# Altium schematic sheet Yo-Radio.SchDoc
size A4; SheetNumber: 1; SheetTotal: 1
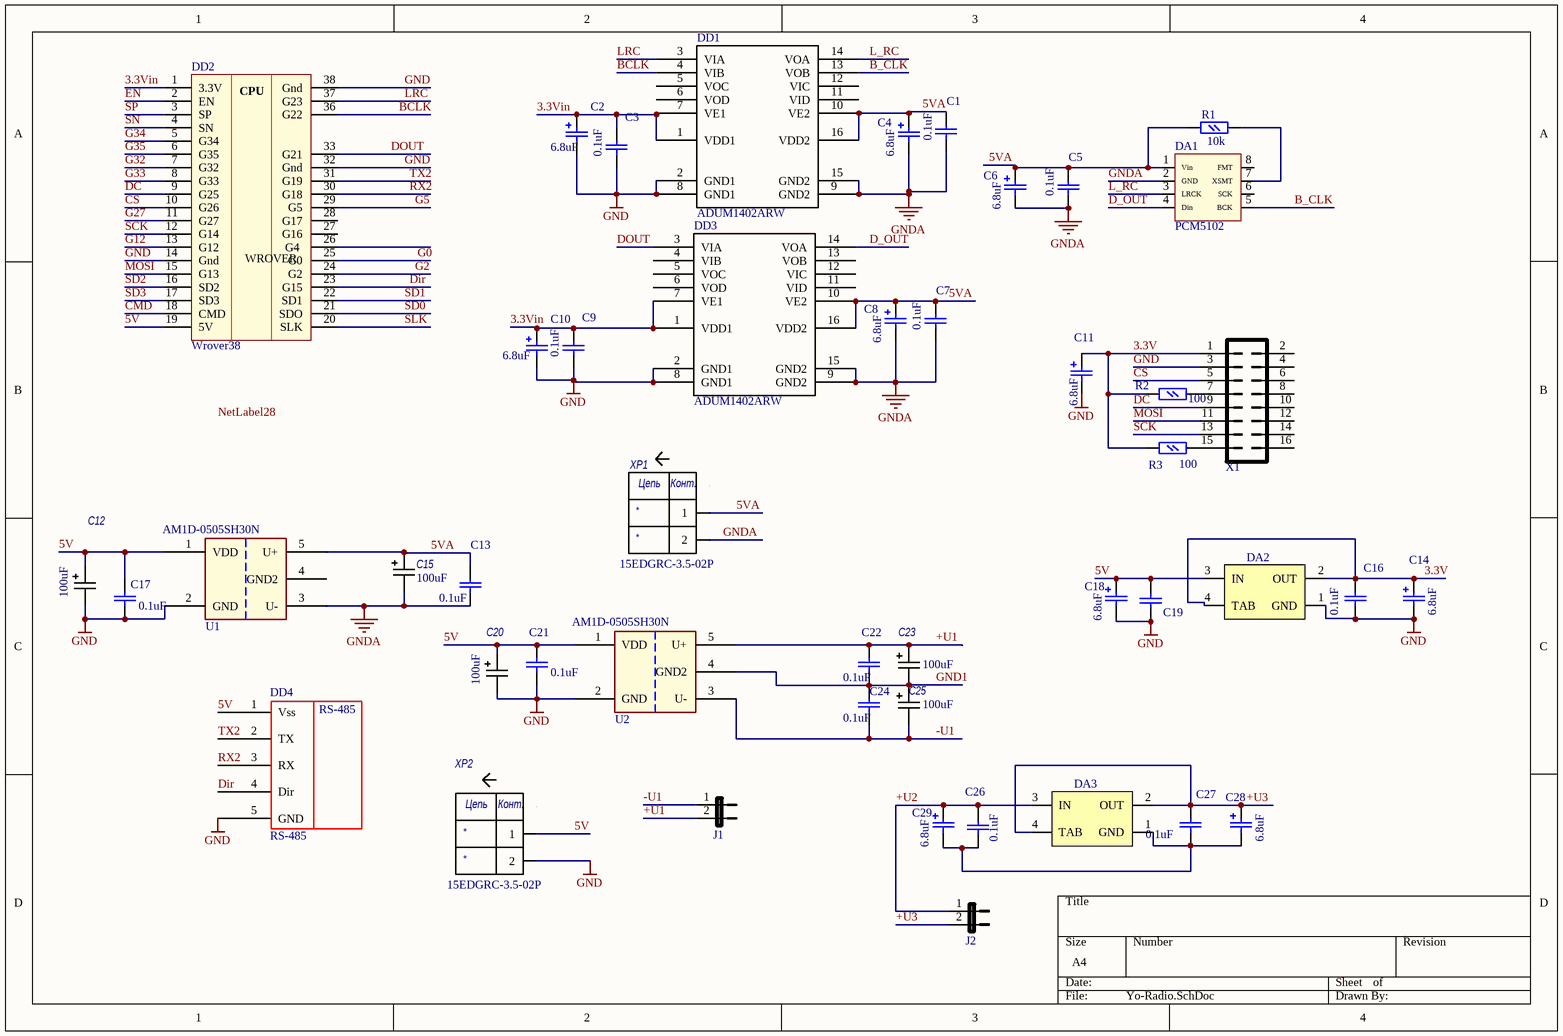
[diagram p0: Yo-Radio.SchDoc]

## Parts
C1  0.1uF  [cap0805]
C2  6.8uF  [TC3216-1206-A]
C3  0.1uF  [cap0805]
C4  6.8uF  [TC3216-1206-A]
C5  0.1uF  [cap0805]
C6  6.8uF  [TC3216-1206-A]
C7  0.1uF  [cap0805]
C8  6.8uF  [TC3216-1206-A]
C9  0.1uF  [cap0805]
C10  6.8uF  [TC3216-1206-A]
C11  6.8uF  [TC3216-1206-A]
C12  ValueSCH: 100uF  [TC7360-2924-E]
C13  0.1uF  [cap0805]
C14  6.8uF  [TC3216-1206-A]
C15  100uF  [TC7360-2924-E]
C16  0.1uF  [cap0805]
C17  0.1uF  [cap0805]
C18  6.8uF  [TC3216-1206-A]
C19  *  [cap0805]  (value not drawn)
C20  ValueSCH: 100uF  [TC7360-2924-E]
C21  0.1uF  [cap0805]
C22  0.1uF  [cap0805]
C23  100uF  [TC7360-2924-E]
C24  0.1uF  [cap0805]
C25  100uF  [TC7360-2924-E]
C26  0.1uF  [cap0805]
C27  0.1uF  [cap0805]
C28  6.8uF  [TC3216-1206-A]
C29  6.8uF  [TC3216-1206-A]
DA1  PCM5102  [PCM5102]
DA2  LM1117MP-3.3  [SOT223]  (value not drawn)
DA3  LM1117MP-3.3  [SOT223]  (value not drawn)
DD1  ADUM1402ARW  [WSO-16]
DD2  Wrover38  [Wrover]
DD3  ADUM1402ARW  [WSO-16]
DD4  RS-485  [RS-485]
J1  PLS-2  [PLS-2]  (value not drawn)
J2  PLS-2  [PLS-2]  (value not drawn)
R1  10k  [res0805]
R2  100  [res0805]
R3  100  [res0805]
U1  AM1D-0505SH30N  [AM1D_3kV]
U2  AM1D-0505SH30N  [AM1D_3kV]
X1  PBD-16  [TFT]  (value not drawn)
XP1  15EDGRC-3.5-02P  [15EDGRC-3.5-02P]
XP2  15EDGRC-3.5-02P  [15EDGRC-3.5-02P]

## Nets
GND: C2.2 C3.2 C9.2 C10.2 C11.2 C12.2 C14.2 C16.2 C17.2 C18.2 C19.2 C20.2 C21.2 DA2.1(GND) DD1.2(GND1) DD1.8(GND1) DD2.14(Gnd) DD2.32(Gnd) DD2.38(Gnd) DD3.2(GND1) DD3.8(GND1) DD4.5(GND) U1.2(GND) U2.2(GND) X1.3 XP2.2
GNDA: C1.2 C4.2 C5.2 C6.2 C7.2 C8.2 C13.2 C15.2 DA1.2(GND) DD1.9(GND2) DD1.15(GND2) DD3.9(GND2) DD3.15(GND2) U1.3(U-) XP1.2
3.3V: C11.1 C14.1 C16.1 DA2.2(OUT) DA2.4(TAB) R2.1 R3.1 X1.1
3.3Vin: C2.1 C3.1 C9.1 C10.1 DD1.1(VDD1) DD1.7(VE1) DD2.1(3.3V) DD3.1(VDD1) DD3.7(VE1)
5V: C12.1 C17.1 C18.1 C19.1 C20.1 C21.1 DA2.3(IN) DD2.19(5V) DD4.1(Vss) U1.1(VDD) U2.1(VDD) XP2.1
5VA: C1.1 C4.1 C5.1 C6.1 C7.1 C8.1 C13.1 C15.1 DA1.1(Vin) DD1.10(VE2) DD1.16(VDD2) DD3.10(VE2) DD3.16(VDD2) R1.1 U1.5(U+) XP1.1
+U1: C22.1 C23.1 J1.2 U2.5(U+)
+U2: C26.1 C29.1 DA3.3(IN) J2.1
+U3: C27.1 C28.1 DA3.2(OUT) DA3.4(TAB) J2.2
-U1: C24.2 C25.2 J1.1 U2.3(U-)
B_CLK: DA1.5(BCK) DD1.13(VOB)
BCLK: DD1.4(VIB) DD2.36(G22)
CMD: DD2.18(CMD)
CS: DD2.10(G26) X1.5
D_OUT: DA1.4(Din) DD3.14(VOA)
DC: DD2.9(G25) X1.9
Dir: DD2.23(G15) DD4.4(Dir)
DOUT: DD2.33(G21) DD3.3(VIA)
EN: DD2.2(EN)
G0: DD2.25(G0)
G2: DD2.24(G2)
G5: DD2.29(G5)
G12: DD2.13(G12)
G27: DD2.11(G27)
G32: DD2.7(G32)
G33: DD2.8(G33)
G34: DD2.5(G34)
G35: DD2.6(G35)
GND1: C22.2 C23.2 C24.1 C25.1 U2.4(GND2)
L_RC: DA1.3(LRCK) DD1.14(VOA)
LRC: DD1.3(VIA) DD2.37(G23)
MOSI: DD2.15(G13) X1.11
RX2: DD2.30(G18) DD4.3(RX)
SCK: DD2.12(G14) X1.13
SD0: DD2.21(SDO)
SD1: DD2.22(SD1)
SD2: DD2.16(SD2)
SD3: DD2.17(SD3)
SLK: DD2.20(SLK)
SN: DD2.4(SN)
SP: DD2.3(SP)
TX2: DD2.31(G19) DD4.2(TX)
NetC26_2: C26.2 C27.2 C28.2 C29.2 DA3.1(GND)
NetDA1_7: DA1.7(XSMT) R1.2
NetR2_2: R2.2 X1.7
NetR3_2: R3.2 X1.15

Not connected (* = marked no-connect by the designer): DA1 6(SCK) 8(FMT); DD1 5(VOC) 6(VOD) 11(VID) 12(VIC); DD2 26(G4_) 27(G16) 28(G17); DD3 4(VIB) 5(VOC) 6(VOD) 11(VID) 12(VIC) 13(VOB); U1 4(GND2); X1 2 4 6 8 10 12 14 16

## Notes on the sheet
- Labels drawn without touching a wire or pin: NetLabel28
- (in symbol 15EDGRC-3.5-02P) Цепь; Конт.
- (in symbol Wrover38) CPU; WROVER

## Library data of the parts
C1 C3 C5 C7 C9 C13 C16 C17 C19 C21 C22 C24 C26 C27 = cap0805: Керамический конденсатор, SMD; Group: Конденсаторы; NPads: 2; Part Number: cap0805; SType: SMD; Package: SMD 0805
  C1 C3 C5 C7 C9 C13 C17 C19 C21 C22 C24 C26 C27: ValueSCH: *
  C16: ValueSCH: 0.1uF
C2 C4 C6 C8 C10 C11 C14 C18 C28 C29 = capA: Танталовый конденсатор, SMD; Part Number: capA; Group: Конденсаторы; NPads: 2; SType: SMD; ValueSCH: *; Package: SMD A
C12 C15 C20 C23 C25 = capE: Танталовый конденсатор, SMD; Part Number: capE; Group: Конденсаторы; NPads: 2; SType: SMD; Package: SMD E
  C15 C23 C25: ValueSCH: 100uF
DA2 DA3 = LM1117MP-3.3: Линейный стабилизатор 3.3V; Group: Микросхемы; SType: SMD; Analog: SPX1117M3L-3.3; NPads: 4; Part Number: LM1117MP-3.3; ValueSCH: LM1117MP-3.3; Package: SOT223; HelpURL: \DATA\LM1117.pdf
DD1 DD3 = ADUM1402ARW: Цифровой оптрон 4 канала; Group: Микросхемы; SType: SMD; NPads: 16; Part Number: ADUM1402ARW; ValueSCH: ADUM1402ARW; Package: SO-16W
J1 J2 = PLS-2: Однорядный штыревой разъем 2 шаг 2.54мм; Group: Разъемы; SType: TH; NPads: 2; Part Number: PLS-2; ValueSCH: PLS-2
R1-R3 = res0805: Резистор 0.125 W, SMD; Group: Резисторы; NPads: 2; Part Number: res0805; SType: SMD; ValueSCH: *; Package: SMD 0805
U1 U2 = AM1D-0505SH30N: Преобразователь 1Вт 5В ->5В; Group: Микросхемы; SType: TH; NPads: 4; Part Number: AM1D-0505SH30N; ValueSCH: AM1D-0505SH30N; Package: SIP7; HelpURL: \DATA\AM1D.pdf
X1 = PBD-16: Розетка на плату 8х2 контактов.2,54 х 2,54 мм; Group: Разъемы; SType: TH; NPads: 16; Part Number: PBD-16; ValueSCH: PBD-16
XP1 XP2 = 15EDGRC-3.5-02P: Вилка на плату прямой угол 2 конт. шаг 3.5мм; Group: Разъемы; SType: TH; NPads: 2; VariantName1: *; VariantName2: *; Part Number: 15EDGRC-3.5-02P; ValueSCH: 15EDGRC-3.5-02P